# Altium schematic sheet RD15002_SingleSCT.SchDoc: RD15002_SingleSCT.PrjPcb
size A4; DrawnBy: 邓勇杰; Revision: A1.0.0; SheetNumber: 1; SheetTotal: 10; Time: 2015/12/2
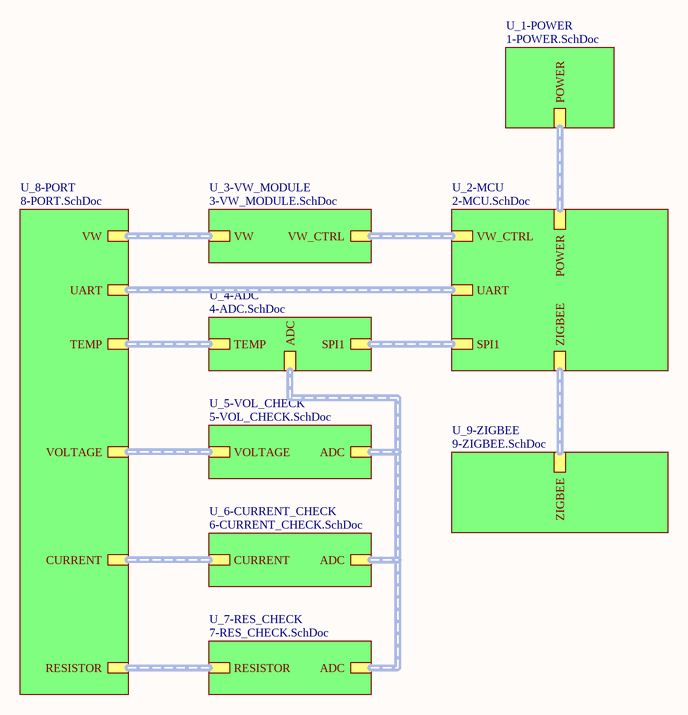
[diagram p0: RD15002_SingleSCT.SchDoc]

## Sub-sheets
U_1-POWER = 1-POWER.SchDoc: POWER (harness POWER)
U_2-MCU = 2-MCU.SchDoc: UART (harness UART), ZIGBEE (harness ZIGBEE), POWER (harness POWER), SPI1 (harness SPI1), VW_CTRL (harness VW_CTRL)
U_3-VW_MODULE = 3-VW_MODULE.SchDoc: VW_CTRL (harness VW_CTRL), VW (harness VW)
U_4-ADC = 4-ADC.SchDoc: SPI1 (harness SPI1), TEMP (harness TEMP), ADC (harness ADC)
U_5-VOL_CHECK = 5-VOL_CHECK.SchDoc: VOLTAGE (harness VOLTAGE), ADC (harness ADC)
U_6-CURRENT_CHECK = 6-CURRENT_CHECK.SchDoc: CURRENT (harness CURRENT), ADC (harness ADC)
U_7-RES_CHECK = 7-RES_CHECK.SchDoc: RESISTOR (harness RESISTOR), ADC (harness ADC)
U_8-PORT = 8-PORT.SchDoc: UART (harness UART), VW (harness VW), TEMP (harness TEMP), VOLTAGE (harness VOLTAGE), CURRENT (harness CURRENT), RESISTOR (harness RESISTOR)
U_9-ZIGBEE = 9-ZIGBEE.SchDoc: ZIGBEE (harness ZIGBEE)

## Buses and harness runs
harness sheet U_1-POWER/POWER = sheet U_2-MCU/POWER
harness sheet U_2-MCU/SPI1 = sheet U_4-ADC/SPI1
harness sheet U_2-MCU/UART = sheet U_8-PORT/UART
harness sheet U_2-MCU/VW_CTRL = sheet U_3-VW_MODULE/VW_CTRL
harness sheet U_2-MCU/ZIGBEE = sheet U_9-ZIGBEE/ZIGBEE
harness sheet U_3-VW_MODULE/VW = sheet U_8-PORT/VW
harness sheet U_4-ADC/ADC = sheet U_5-VOL_CHECK/ADC = sheet U_6-CURRENT_CHECK/ADC = sheet U_7-RES_CHECK/ADC
harness sheet U_4-ADC/TEMP = sheet U_8-PORT/TEMP
harness sheet U_5-VOL_CHECK/VOLTAGE = sheet U_8-PORT/VOLTAGE
harness sheet U_6-CURRENT_CHECK/CURRENT = sheet U_8-PORT/CURRENT
harness sheet U_7-RES_CHECK/RESISTOR = sheet U_8-PORT/RESISTOR

## Notes on the sheet
- 文件版本:
- 原理图名:
- 工 程  名:
- 绘       制:
- 审       核:
- 第   页，共    页
- 日       期: